# EAGLE design Freezer_Proto2 (EAGLE 7.5.0)
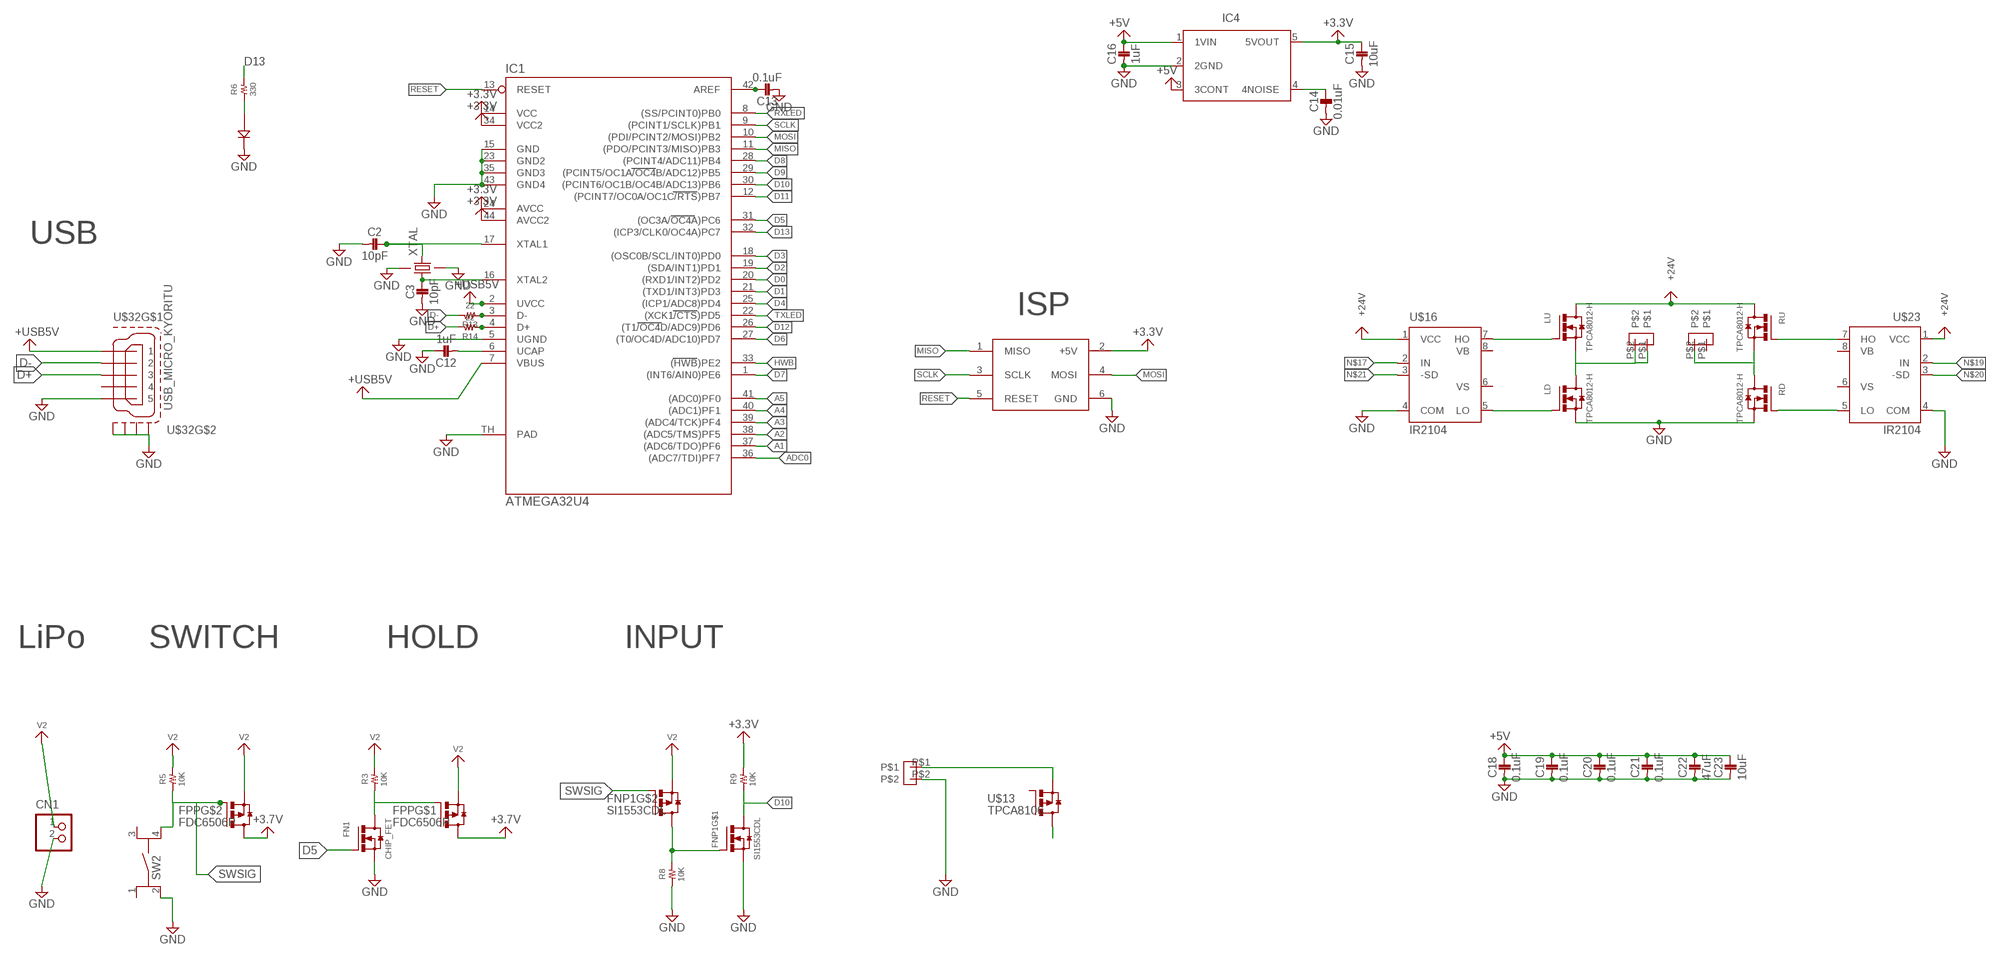
[diagram p0: schematic, sheet 1]

## Parts
C2  10pF  1005  [1005]
C3  10pF  1005  [1005]
C12  1uF  1005  [1005]
C13  0.1uF  1005  [1005]
C14  0.01uF  1608  [1608]
C15  10uF  1608  [1608]
C16  1uF  1005  [1005]
C18  0.1uF  1005  [1005]
C19  0.1uF  1005  [1005]
C20  0.1uF  1005  [1005]
C21  0.1uF  1005  [1005]
C22  47uF  1608  [1608]
C23  10uF  1608  [1608]
CN1  S2B-PH-K-S  [S2B-PH-K-S]
FN1  CHIP_FET  [SOT23]
FNP1  SI1553CDL  [SOT363]
FPP  FDC6506P  [SOT23-6]
IC1  ATMEGA32U4  [QFN-44-7X7]
IC4  TAR5SB  [SSOP5-P-0.95]
LD  TPCA8012-H  [2-5Q1A]
LED1  1608  [1608]
LU  TPCA8012-H  [2-5Q1A]
R3  10K  RESISTOR_1005  [1005]
R5  10K  RESISTOR_1005  [1005]
R6  330  RESISTOR_1005  [1005]
R8  10K  RESISTOR_1005  [1005]
R9  10K  RESISTOR_1005  [1005]
R13  22  RESISTOR_1005  [1005]
R14  22  RESISTOR_1005  [1005]
RD  TPCA8012-H  [2-5Q1A]
RU  TPCA8012-H  [2-5Q1A]
SW2  SKRPACE010  [SKRP]
U$3  ICSP  [ICSP]
U$7  TERMINAL_2P  [TERMINAL_2P]
U$13  TPCA8106  [2-5Q1A]
U$16  IR2104  [SOIC8]
U$23  IR2104  [SOIC8]
U$32  USB_MICRO_KYORITU  [USB_MICRO_KYORITU]
U$38  TERMINAL_2P  [TERMINAL_2P]
U$43  TERMINAL_2P  [TERMINAL_2P]
XTAL  FA-238  [FA-238]

## Nets
+3.3V: C15.P$1 IC1.14(VCC) IC1.24(AVCC) IC1.34(VCC2) IC1.44(AVCC2) IC4.5(5VOUT) R9.2 U$3.2(+5V)
+3.7V: FPP.4(D) FPP.6(D)
+5V: C16.1 C18.1 C19.1 C20.1 C21.1 C22.P$1 C23.P$1 IC4.1(1VIN) IC4.3(3CONT)
+24V: LU.5(D) LU.6(D) LU.7(D) LU.8(D) RU.5(D) RU.6(D) RU.7(D) RU.8(D) U$16.1(VCC) U$23.1(VCC)
+USB5V: IC1.2(UVCC) IC1.7(VBUS) U$32.1
A1: IC1.37((ADC6/TDO)PF6)
A2: IC1.38((ADC5/TMS)PF5)
A3: IC1.39((ADC4/TCK)PF4)
A4: IC1.40((ADC1)PF1)
A5: IC1.41((ADC0)PF0)
ADC0: IC1.36((ADC7/TDI)PF7)
D0: IC1.20((RXD1/INT2)PD2)
D1: IC1.21((TXD1/INT3)PD3)
D2: IC1.19((SDA/INT1)PD1)
D3: IC1.18((OSC0B/SCL/INT0)PD0)
D4: IC1.25((ICP1/ADC8)PD4)
D5: FN1.1(G) IC1.31((OC3A/OC4A)PC6)
D6: IC1.27((T0/OC4D/ADC10)PD7)
D7: IC1.1((INT6/AIN0)PE6)
D8: IC1.28((PCINT4/ADC11)PB4)
D9: IC1.29((PCINT5/OC1A/OC4B/ADC12)PB5)
D10: FNP1.6(D) IC1.30((PCINT6/OC1B/OC4B/ADC13)PB6) R9.1
D11: IC1.12((PCINT7/OC0A/OC1C/RTS)PB7)
D12: IC1.26((T1/OC4D/ADC9)PD6)
D13: IC1.32((ICP3/CLK0/OC4A)PC7) R6.2
D+: R14.2 U$32.3
D-: R13.2 U$32.2
GND: C2.2 C3.2 C12.1 C13.2 C14.P$2 C15.P$2 C16.2 C18.2 C19.2 C20.2 C21.2 C22.P$2 C23.P$2 CN1.2 FN1.2(S) FNP1.1(S) IC1.5(UGND) IC1.15(GND) IC1.23(GND2) IC1.35(GND3) IC1.43(GND4) IC1.TH(PAD) IC4.2(2GND) LD.1(S) LD.2(S) LD.3(S) LED1.2(K) R8.1 RD.1(S) RD.2(S) RD.3(S) SW2.2(1_) U$3.6(GND) U$7.P$2 U$16.4(COM) U$23.4(COM) U$32.5 U$32.M1(S1) U$32.M2(S2) U$32.M3(S3) U$32.M4(S4) XTAL.2 XTAL.4
HWB: IC1.33((HWB)PE2)
MISO: IC1.11((PDO/PCINT3/MISO)PB3) U$3.1(MISO)
MOSI: IC1.10((PDI/PCINT2/MOSI)PB2) U$3.4(MOSI)
N$1: LED1.1(A) R6.1
N$2: U$7.P$1 U$13.1(S) U$13.2(S) U$13.3(S)
N$4: RU.4(G) U$23.7(HO)
N$5: U$13.5(D) U$13.6(D) U$13.7(D) U$13.8(D)
N$6: FN1.3(D) FPP.1(G) R3.1
N$7: C3.1 IC1.16(XTAL2) XTAL.1
N$8: IC1.3(D-) R13.1
N$9: C13.1 IC1.42(AREF)
N$10: C2.1 IC1.17(XTAL1) XTAL.3
N$12: RD.4(G) U$23.5(LO)
N$13: LU.4(G) U$16.7(HO)
N$14: IC1.4(D+) R14.1
N$15: LD.4(G) U$16.5(LO)
N$16: C14.P$1 IC4.4(4NOISE)
N$17: U$16.2(IN)
N$18: C12.2 IC1.6(UCAP)
N$19: U$23.2(IN)
N$20: U$23.3(-SD)
N$21: U$16.3(-SD)
P+: LD.5(D) LD.6(D) LD.7(D) LD.8(D) LU.1(S) LU.2(S) LU.3(S) U$38.P$1 U$38.P$2
P-: RD.5(D) RD.6(D) RD.7(D) RD.8(D) RU.1(S) RU.2(S) RU.3(S) U$43.P$2
RESET: IC1.13(RESET) U$3.5(RESET)
RXLED: IC1.8((SS/PCINT0)PB0)
SCLK: IC1.9((PCINT1/SCLK)PB1) U$3.3(SCLK)
SIG: FNP1.2(G) FNP1.3(D) R8.2
SWSIG: FNP1.5(G) FPP.3(G) R5.1 SW2.4(2_)
TXLED: IC1.22((XCK1/CTS)PD5)
V2: CN1.1 FNP1.4(S) FPP.2(S) FPP.5(S) R3.2 R5.2
Unconnected: SW2.1 SW2.3 U$13.4(G) U$16.6(VS) U$16.8(VB) U$23.6(VS) U$23.8(VB) U$32.4 U$43.P$1

## Notes on the sheet
- USB
- ISP
- LiPo | SWITCH | HOLD | INPUT

## Library data of the parts
C2 C3 C12 C13 C16 C18-C21 = 02_C:1005
C14 C15 C22 C23 = 02_C:1608
CN1 = jst-ph1:S2B-PH-*: Wire-to-Board 2.0mm pitch side mount connector Source: http://www.jst-mfg.com/product/pdf/jpn/PH.pdf http://www.jst-mfg.com/product/detail.php?series=199
FN1 = 06_FET:CHIP_FET
FNP1 = 06_FET:SI1553CDL
FPP = 06_FET:FDC6506P
IC1 = 04_IC:ATMEGA32U4
IC4 = 04_IC:TAR5SB
LD LU RD RU = 06_FET:TPCA8012-H
LED1 = 10_LED:1608
R3 R5 R6 R8 R9 R13 R14 = 01_R:RESISTOR_1005
SW2 = 09_1_switch:SKRPACE010
U$3 = 08_CONECTOR:ICSP
U$7 U$38 U$43 = 08_CONECTOR:TERMINAL_2P
U$13 = 06_FET:TPCA8106
U$16 U$23 = 04_IC:IR2104
U$32 = 08_CONECTOR:USB_MICRO_KYORITU
XTAL = 09_2_CRYSTAL:FA-238

## Net classes
1 POWER: width 0.5 mm, clearance 0.5 mm

## Board
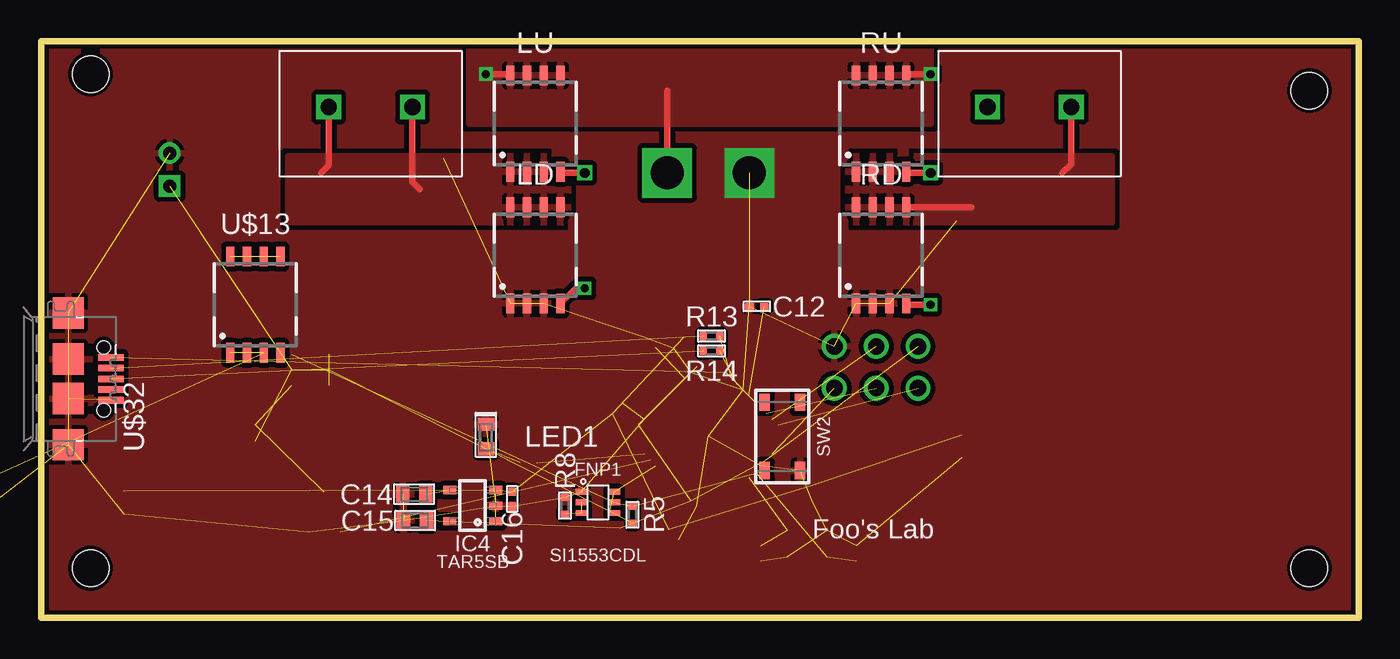
[diagram p1: board, top side]
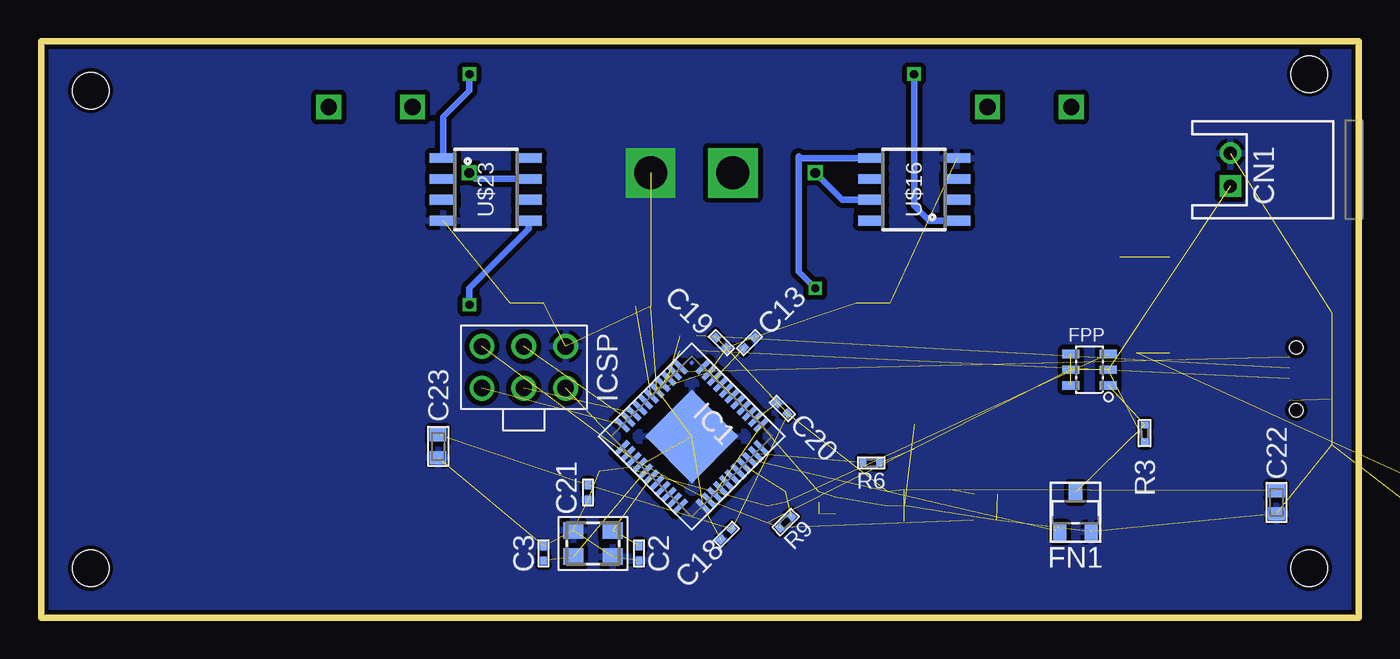
[diagram p2: board, bottom side, seen from below]

Size 80 x 35 mm. Coordinates in mm from the lower left corner, seen from the top.
Outline: 0,0 80,0 80,35 0,35 0,0
Copper layers (1*16): Top 0.035mm / dielectric 1.5mm / Bottom 0.035mm
Design rules "LPKF": minimum track width 6mil, minimum drill 12mil, track to track 0.3mm, track to pad 0.3mm, pad to pad 0.3mm, via to via 0.3mm, smd to smd 0mil, copper to edge 10mil, drill to drill 0.4mm, minimum pad ring 10mil, minimum via ring 6mil, stop-mask expansion 2mil, vias tented up to drill 100mil, thermal gap 10mil
Holes 2.2 mm at 3,3 77,32 3,33 77,3
bKeepout: area 48.5,9.5 to 51.5,12.5; area 8.5,9.5 to 11.5,12.5

### Footprints (pad centres in the part's own frame; a part is rotated, then mirrored left to right if it is on the bottom)
1005 = smd 0.5 x 0.4: 1 -0.45,0; 2 0.45,0
1608 = smd 0.8 x 1: P$1 -0.7,0; P$2 0.7,0
S2B-PH-K-S = drill 0.8 square: 1 1,0 | drill 0.8: 2 -1,0
SOT23 = smd 0.8 x 1: 1 -0.95,-1.2; 2 0.95,-1.2; 3 0,1.2
SOT363 = smd 0.35 x 0.7: 1 -0.65,-1; 2 0,-1; 3 0.65,-1; 4 0.65,1; 5 0,1; 6 -0.65,1
SOT23-6 = smd 0.508 x 1.016: 1 -0.95,-1.143; 2 0,-1.143; 3 0.95,-1.143; 4 0.95,1.143; 5 0,1.143; 6 -0.95,1.143
QFN-44-7X7 = smd 1.1 x 0.3: 1 -3.5,2.5; 2 -3.5,2; 3 -3.5,1.5; 4 -3.5,1; 5 -3.5,0.5; 6 -3.5,0; 7 -3.5,-0.5; 8 -3.5,-1; 9 -3.5,-1.5; 10 -3.5,-2; 11 -3.5,-2.5; 23 3.5,-2.5; 24 3.5,-2; 25 3.5,-1.5; 26 3.5,-1; 27 3.5,-0.5; 28 3.5,0; 29 3.5,0.5; 30 3.5,1; 31 3.5,1.5; 32 3.5,2; 33 3.5,2.5 | smd 0.3 x 1.1: 12 -2.5,-3.5; 13 -2,-3.5; 14 -1.5,-3.5; 15 -1,-3.5; 16 -0.5,-3.5; 17 0,-3.5; 18 0.5,-3.5; 19 1,-3.5; 20 1.5,-3.5; 21 2,-3.5; 22 2.5,-3.5; 34 2.5,3.5; 35 2,3.5; 36 1.5,3.5; 37 1,3.5; 38 0.5,3.5; 39 0,3.5; 40 -0.5,3.5; 41 -1,3.5; 42 -1.5,3.5; 43 -2,3.5; 44 -2.5,3.5 | smd 4 x 4: TH 0,0
SSOP5-P-0.95 = smd 0.5 x 0.8: 1 -0.95,-1.4; 2 0,-1.4; 3 0.95,-1.4; 4 0.95,1.4; 5 -0.95,1.4
2-5Q1A = smd 0.5 x 1.2: 1 -1.524,-2.921; 2 -0.508,-2.921; 3 0.508,-2.921; 4 1.524,-2.921; 5 1.524,2.921; 6 0.508,2.921; 7 -0.508,2.921; 8 -1.524,2.921
1608' = smd 0.8 x 1: 1 -0.75,0; 2 0.75,0
1005' = smd 0.4 x 0.5: 1 -0.5,0; 2 0.5,0
SKRP = smd 1.05 x 0.65: 1 -2.075,1.075; 2 2.075,1.075; 3 -2.075,-1.075; 4 2.075,-1.075
ICSP = drill 1 pad 1.5: 1 -1.27,2.54; 2 1.27,2.54; 3 -1.27,0; 4 1.27,0; 5 -1.27,-2.54; 6 1.27,-2.54
TERMINAL_2P = drill 1 square: P$1 0,2.54; P$2 0,-2.54
SOIC8 = smd 0.6 x 1.6: 1 -1.905,-2.6; 2 -0.635,-2.6; 3 0.635,-2.6; 4 1.905,-2.6; 5 1.905,2.6; 6 0.635,2.6; 7 -0.635,2.6; 8 -1.905,2.6
USB_MICRO_KYORITU = smd 0.4 x 1.55: 1 -1.3,-0.775; 2 -0.65,-0.775; 3 0,-0.775; 4 0.65,-0.775; 5 1.3,-0.775 | smd 1.9 x 1.9: M1 4,-3.35; M2 -4,-3.35; M3 -1.2,-3.35; M4 1.2,-3.35 | hole 0.8: -1.9,-1.2; 1.9,-1.2
FA-238 = smd 1.2 x 1: 1 -1.2,-0.8; 2 1.2,-0.8; 3 1.2,0.8; 4 -1.2,0.8

### Placement (x,y rotation side)
C2  43.7,3.9 270 bottom
C3  49.5,3.9 90 bottom
C12  43.45,18.9 0 top
C13  37,16.7 45 bottom
C14  22.65,7.5 180 top
C15  22.7,5.9 180 top
C16  28.6,7.2 270 top
C18  38.4,5.05 225 bottom
C19  38.7,16.7 315 bottom
C20  35,12.7 135 bottom
C21  46.8,7.6 270 bottom
C22  5,7 270 bottom
C23  55.9,10.4 270 bottom
CN1  7.8,27.2 270 bottom
FN1  17.2,6.4 0 bottom
FNP1  33.8,7 270 top
FPP  16.35,15.05 90 bottom
IC1  40.5,11 315 bottom
IC4  26.2,6.8 90 top
LD  30,22 0 top
LED1  1608  [1608']  27,11 90 top
LU  30,30 0 top
R3  10K  [1005']  13,11.2 270 bottom
R5  10K  [1005']  35.9,6.25 270 top
R6  330  [1005']  29.6,9.4 180 bottom
R8  10K  [1005']  31.8,6.8 270 top
R9  10K  [1005']  34.8,5.8 225 bottom
R13  22  [1005']  40.7,17.1 180 top
R14  22  [1005']  40.7,16.2 180 top
RD  51,22 0 top
RU  51,30 0 top
SW2  45,11 270 top
U$3  50.7,15.2 90 bottom
U$7  -14,1 0 top  (outside the outline)
U$13  13,19 0 top
U$16  27,26 90 bottom
U$23  53,26 270 bottom
U$32  5,14.5 270 top
U$38  20,31 90 top
U$43  60,31 90 top
XTAL  46.5,4.5 0 bottom

### Tracks (layer width: path | path; a pad name or v marks a point on that pad's centre or on a via)
+3.3V  (7 unrouted)
+3.7V  (1 unrouted)
+5V  (8 unrouted)
+24V  (via drill 0.5, 2)
  Top 0.4: v54,33 52.6,33 RU.5
  Top 0.406: v38,27 38,32 | v27,33 28.4,33 LU.8
  Bottom 0.4: U$23.1 55.6,30.4 54,32 v54,33
  Bottom 0.406: U$16.1 26.09,24.09 27,25 v27,33
  pour Top: 26,37 54,37 54,30 26,30
+USB5V  (2 unrouted)
D5  (1 unrouted)
D10  (2 unrouted)
D13  (1 unrouted)
D+  (1 unrouted)
D-  (1 unrouted)
GND  (via drill 2)  (43 unrouted)
  other vias: 43,27
  pour Bottom (rank 6): -10,47 89,47 89,-5 -10,-5
  pour Top (rank 6): -10,40 91,40 91,-5 -10,-5
  pour Top: 27,22 54,22 54,18 27,18
MISO  (1 unrouted)
MOSI  (1 unrouted)
N$1  (1 unrouted)
N$2  (3 unrouted)
N$4  (via drill 0.6)
  Top 0.406: v54,27 52.6,27 RU.4
  Bottom 0.406: U$23.7 53.63,26.64 v54,27
N$5  (3 unrouted)
N$6  (2 unrouted)
N$7  (2 unrouted)
N$8  (1 unrouted)
N$9  (1 unrouted)
N$10  (2 unrouted)
N$12  (via drill 0.5)
  Top 0.4: v54,19 52.6,19 RD.4
  Bottom 0.4: U$23.5 50.4,23.6 54,20 v54,19
N$13  (via drill 0.6)
  Top 0.406: v33,27 31.6,27 LU.4
  Bottom 0.406: U$16.7 31.36,25.36 v33,27
N$14  (1 unrouted)
N$15  (via drill 0.5)
  Top 0.4: v33,20 32.45,20 LD.4
  Bottom 0.4: U$16.5 33.91,27.91 34,28 34,21 v33,20
N$16  (1 unrouted)
N$18  (1 unrouted)
P+
  Top 0.406: U$38.P$2 22.54,26.46 23,26 | U$38.P$1 17.46,27.46 17,27
  pour Top: 32,28 32,24 15,24 15,28
P-
  Top 0.406: 56.46,24.92 RD.5 | U$43.P$2 62.54,27.54 62,27
  pour Top: 49,28 65,28 65,24 49,24
RESET  (1 unrouted)
SCLK  (1 unrouted)
SIG  (2 unrouted)
SWSIG  (3 unrouted)
V2  (5 unrouted)

### Text on the board
tPlace: Foo's Lab
_bPlace: L1
_tNames: C12 | R1 | FN4 | R2 | R13 | IC2 | R14 | C7 | C8 | LED1 | SW2 | R8 | C14 | C16 | C15 | R5 | IC4 | FNP1 | D2 | R17 | R16
_bNames: D1 | C6 | CN1 | C19 | C5 | R18 | C13 | IC3 | R15 | R11 | C23 | FPP | C1 | R3 | IC1 | R6 | C20 | FN1 | C22 | C21 | BLE | R9 | C2 | C3 | C18 | R4